# Altium schematic sheet REGENIX_Relais_24V_1.SchDoc
size Tabloid; Date: Date; Author: Author 1; DocumentNumber: 2; Revision: 1; SheetNumber: 14; SheetTotal: 17; Size: 11x17; Sheet_Name: BATTERY PROTECTION & AUXILIARY
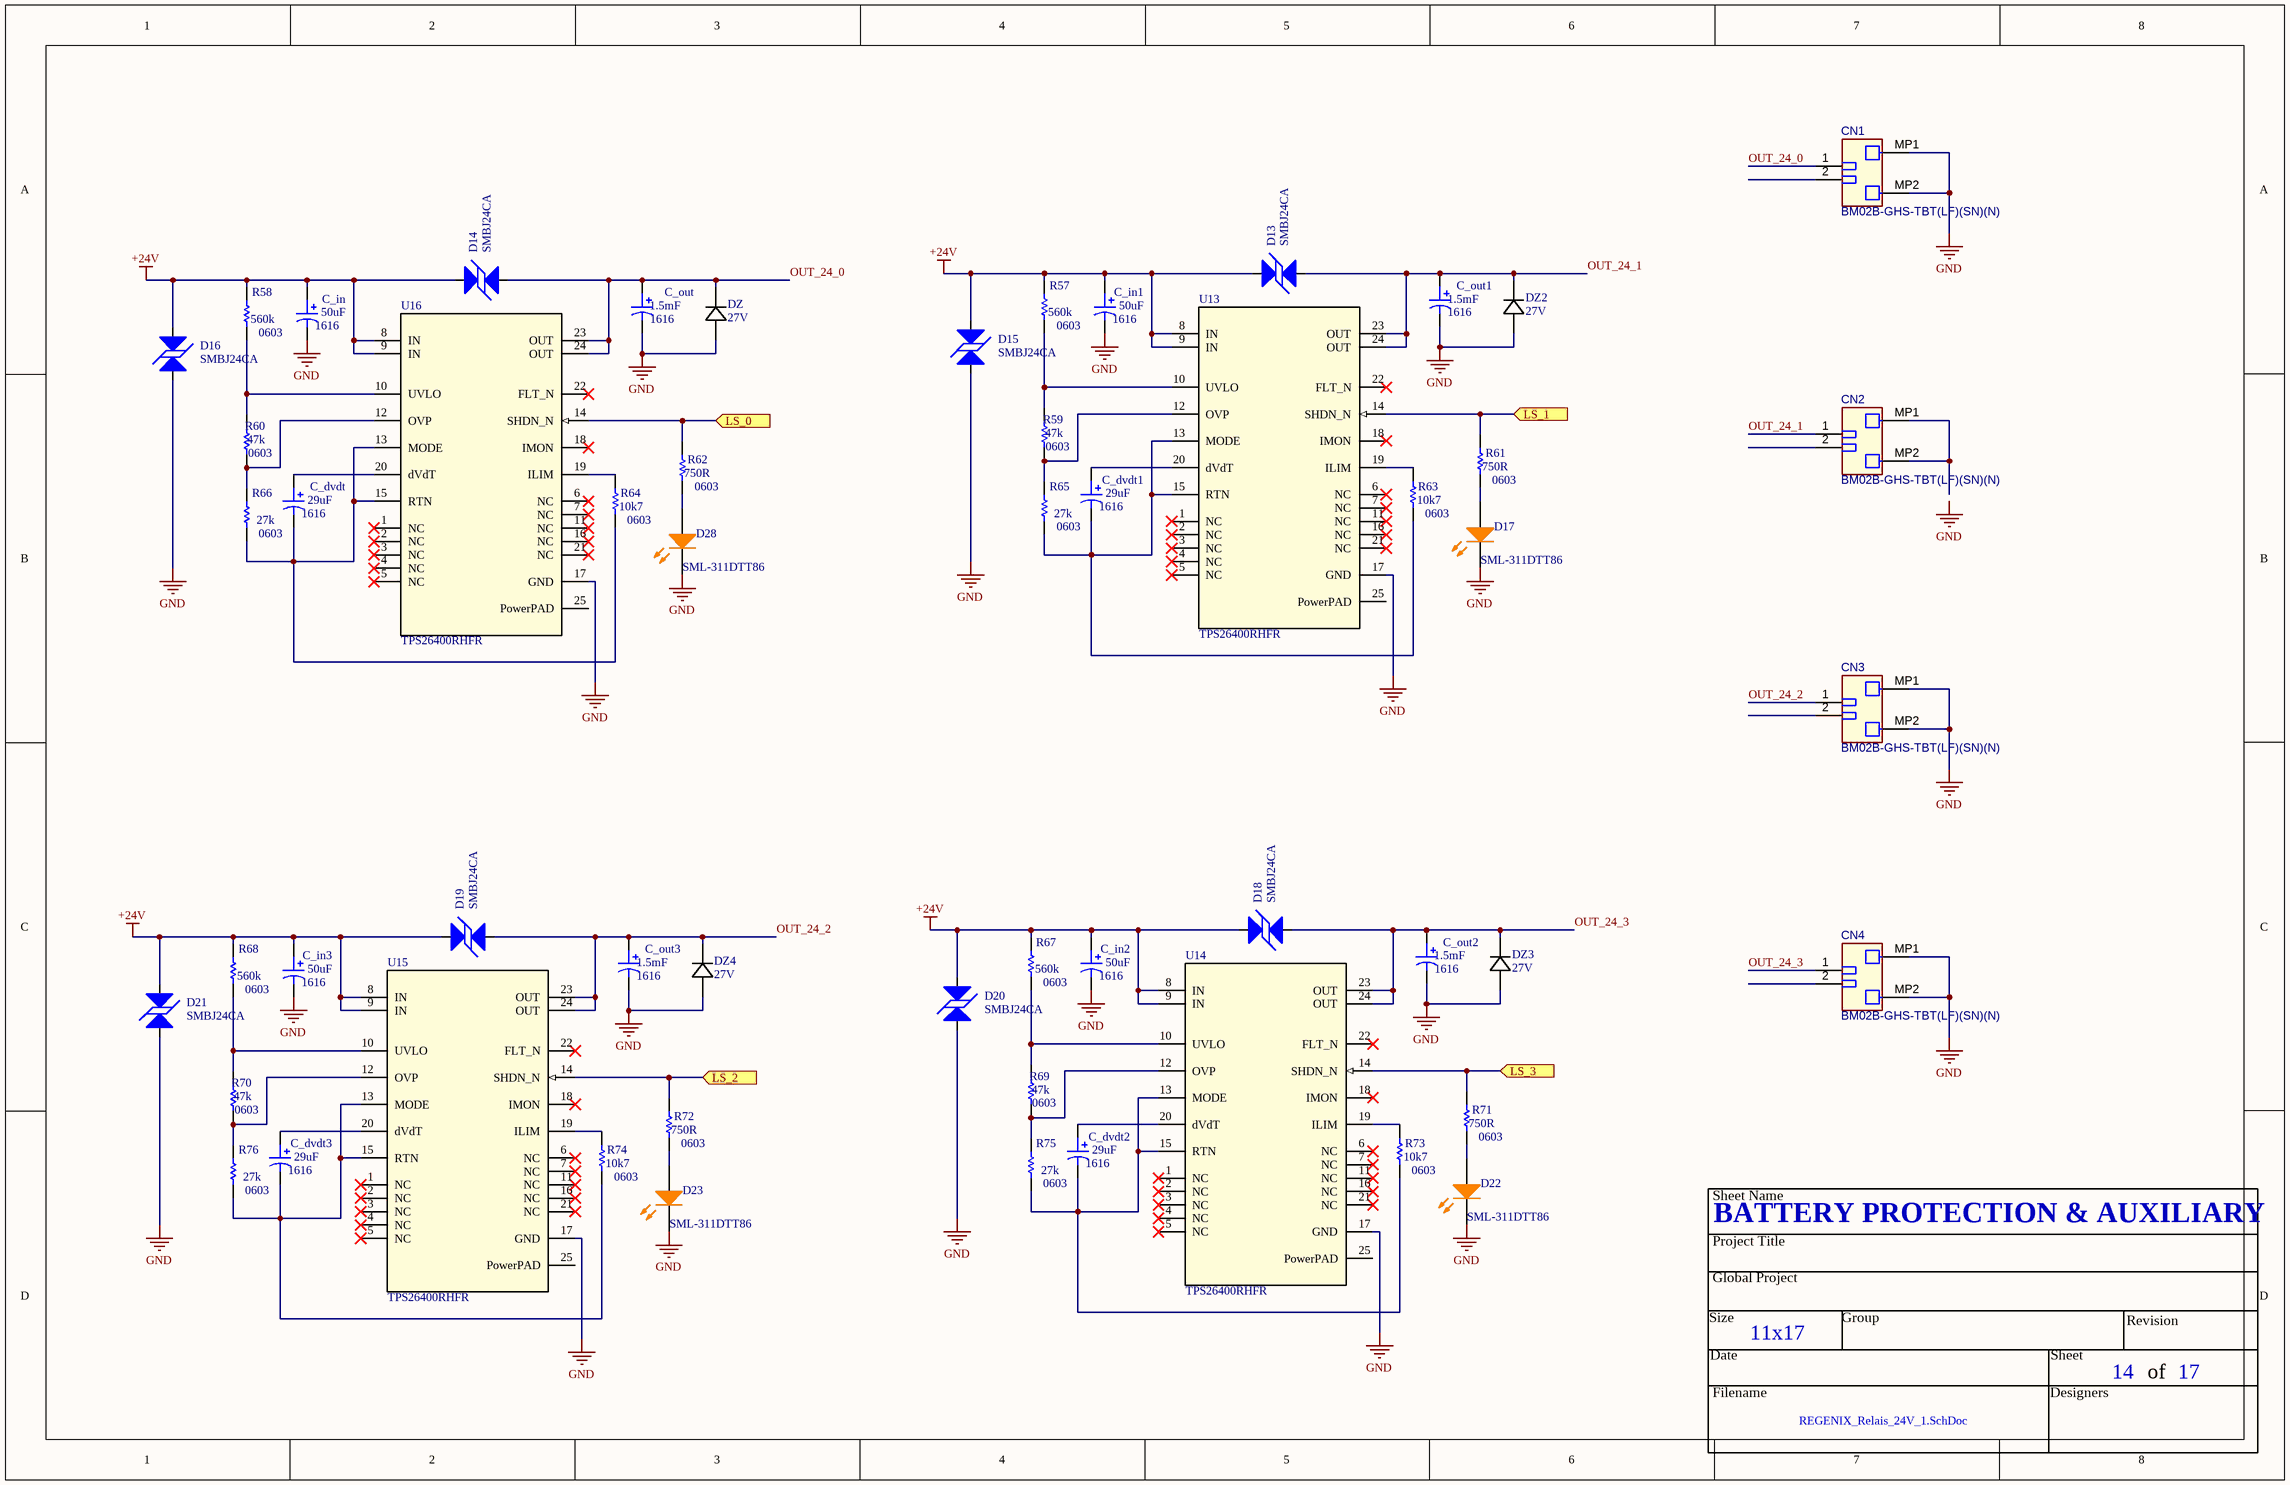
[diagram p0: REGENIX_Relais_24V_1.SchDoc]

## Parts
C_dvdt  value 29uF  Package: 1616  [CAP_ALU_1616_vishay]  (hidden comment: MAL214699108E3)
C_dvdt1  value 29uF  Package: 1616  [CAP_ALU_1616_vishay]  (hidden comment: MAL214699108E3)
C_dvdt2  value 29uF  Package: 1616  [CAP_ALU_1616_vishay]  (hidden comment: MAL214699108E3)
C_dvdt3  value 29uF  Package: 1616  [CAP_ALU_1616_vishay]  (hidden comment: MAL214699108E3)
C_in  value 50uF  Package: 1616  [CAP_ALU_1616_vishay]  (hidden comment: MAL214699108E3)
C_in1  value 50uF  Package: 1616  [CAP_ALU_1616_vishay]  (hidden comment: MAL214699108E3)
C_in2  value 50uF  Package: 1616  [CAP_ALU_1616_vishay]  (hidden comment: MAL214699108E3)
C_in3  value 50uF  Package: 1616  [CAP_ALU_1616_vishay]  (hidden comment: MAL214699108E3)
C_out  value 1.5mF  Package: 1616  [CAP_ALU_1616_vishay]  (hidden comment: MAL214699108E3)
C_out1  value 1.5mF  Package: 1616  [CAP_ALU_1616_vishay]  (hidden comment: MAL214699108E3)
C_out2  value 1.5mF  Package: 1616  [CAP_ALU_1616_vishay]  (hidden comment: MAL214699108E3)
C_out3  value 1.5mF  Package: 1616  [CAP_ALU_1616_vishay]  (hidden comment: MAL214699108E3)
CN1  BM02B-GHS-TBT(LF)(SN)(N)  [JST-BM02B-GHS-TBT_V]
CN2  BM02B-GHS-TBT(LF)(SN)(N)  [JST-BM02B-GHS-TBT_V]
CN3  BM02B-GHS-TBT(LF)(SN)(N)  [JST-BM02B-GHS-TBT_V]
CN4  BM02B-GHS-TBT(LF)(SN)(N)  [JST-BM02B-GHS-TBT_V]
D13  SMBJ24CA  [TVS_PWR_SMBJ36CA]
D14  SMBJ24CA  [TVS_PWR_SMBJ36CA]
D15  SMBJ24CA  [TVS_PWR_SMBJ36CA]
D16  SMBJ24CA  [TVS_PWR_SMBJ36CA]
D17  SML-311DTT86  [LED_0603]
D18  SMBJ24CA  [TVS_PWR_SMBJ36CA]
D19  SMBJ24CA  [TVS_PWR_SMBJ36CA]
D20  SMBJ24CA  [TVS_PWR_SMBJ36CA]
D21  SMBJ24CA  [TVS_PWR_SMBJ36CA]
D22  SML-311DTT86  [LED_0603]
D23  SML-311DTT86  [LED_0603]
D28  SML-311DTT86  [LED_0603]
DZ  27V  [SOD123_DIO]
DZ2  27V  [SOD123_DIO]
DZ3  27V  [SOD123_DIO]
DZ4  27V  [SOD123_DIO]
R57  Package: 0603  Precision: 560k  [RES_0603]  (hidden comment: RES - 0603)
R58  Package: 0603  Precision: 560k  [RES_0603]  (hidden comment: RES - 0603)
R59  Package: 0603  Precision: 47k  [RES_0603]  (hidden comment: RES - 0603)
R60  Package: 0603  Precision: 47k  [RES_0603]  (hidden comment: RES - 0603)
R61  Package: 0603  Precision: 750R  [RES_0603]  (hidden comment: RES - 0603)
R62  Package: 0603  Precision: 750R  [RES_0603]  (hidden comment: RES - 0603)
R63  Package: 0603  Precision: 10k7  [RES_0603]  (hidden comment: RES - 0603)
R64  Package: 0603  Precision: 10k7  [RES_0603]  (hidden comment: RES - 0603)
R65  Package: 0603  Precision: 27k  [RES_0603]  (hidden comment: RES - 0603)
R66  Package: 0603  Precision: 27k  [RES_0603]  (hidden comment: RES - 0603)
R67  Package: 0603  Precision: 560k  [RES_0603]  (hidden comment: RES - 0603)
R68  Package: 0603  Precision: 560k  [RES_0603]  (hidden comment: RES - 0603)
R69  Package: 0603  Precision: 47k  [RES_0603]  (hidden comment: RES - 0603)
R70  Package: 0603  Precision: 47k  [RES_0603]  (hidden comment: RES - 0603)
R71  Package: 0603  Precision: 750R  [RES_0603]  (hidden comment: RES - 0603)
R72  Package: 0603  Precision: 750R  [RES_0603]  (hidden comment: RES - 0603)
R73  Package: 0603  Precision: 10k7  [RES_0603]  (hidden comment: RES - 0603)
R74  Package: 0603  Precision: 10k7  [RES_0603]  (hidden comment: RES - 0603)
R75  Package: 0603  Precision: 27k  [RES_0603]  (hidden comment: RES - 0603)
R76  Package: 0603  Precision: 27k  [RES_0603]  (hidden comment: RES - 0603)
U13  TPS26400RHFR  [RHF0024A-IPC_A]
U14  TPS26400RHFR  [RHF0024A-IPC_A]
U15  TPS26400RHFR  [RHF0024A-IPC_A]
U16  TPS26400RHFR  [RHF0024A-IPC_A]

## Ports
LS_0 (in), LS_1 (in), LS_2 (in), LS_3 (in)

## Nets
+24V: C_in.1 C_in1.1 C_in2.1 C_in3.1 D13.1 D14.1 D15.1 D16.1 D18.1 D19.1 D20.1 D21.1 R57.2 R58.2 R67.2 R68.2 U13.8(IN) U13.9(IN) U14.8(IN) U14.9(IN) U15.8(IN) U15.9(IN) U16.8(IN) U16.9(IN)
GND: C_in.2 C_in1.2 C_in2.2 C_in3.2 C_out.2 C_out1.2 C_out2.2 C_out3.2 CN1.MP1 CN1.MP2 CN3.MP1 CN3.MP2 CN4.MP1 CN4.MP2 D15.2 D16.2 D17.K D20.2 D21.2 D22.K D23.K D28.K DZ.2 DZ2.2 DZ3.2 DZ4.2 U13.17(GND) U14.17(GND) U15.17(GND) U16.17(GND)
LS_0: R62.2 U16.14(SHDN_N) ; port LS_0
LS_1: R61.2 U13.14(SHDN_N) ; port LS_1
LS_2: R72.2 U15.14(SHDN_N) ; port LS_2
LS_3: R71.2 U14.14(SHDN_N) ; port LS_3
OUT_24_0: C_out.1 CN1.1 D14.2 DZ.1 U16.23(OUT) U16.24(OUT)
OUT_24_1: C_out1.1 CN2.1 D13.2 DZ2.1 U13.23(OUT) U13.24(OUT)
OUT_24_2: C_out3.1 CN3.1 D19.2 DZ4.1 U15.23(OUT) U15.24(OUT)
OUT_24_3: C_out2.1 CN4.1 D18.2 DZ3.1 U14.23(OUT) U14.24(OUT)
NetC_dvdt1_1: C_dvdt1.1 U13.20(dVdT)
NetC_dvdt1_2: C_dvdt1.2 R63.1 R65.1 U13.13(MODE) U13.15(RTN)
NetC_dvdt2_1: C_dvdt2.1 U14.20(dVdT)
NetC_dvdt2_2: C_dvdt2.2 R73.1 R75.1 U14.13(MODE) U14.15(RTN)
NetC_dvdt3_1: C_dvdt3.1 U15.20(dVdT)
NetC_dvdt3_2: C_dvdt3.2 R74.1 R76.1 U15.13(MODE) U15.15(RTN)
NetC_dvdt_1: C_dvdt.1 U16.20(dVdT)
NetC_dvdt_2: C_dvdt.2 R64.1 R66.1 U16.13(MODE) U16.15(RTN)
NetCN2_MP1: CN2.MP1 CN2.MP2
NetD17_A: D17.A R61.1
NetD22_A: D22.A R71.1
NetD23_A: D23.A R72.1
NetD28_A: D28.A R62.1
NetR57_1: R57.1 R59.2 U13.10(UVLO)
NetR58_1: R58.1 R60.2 U16.10(UVLO)
NetR59_1: R59.1 R65.2 U13.12(OVP)
NetR60_1: R60.1 R66.2 U16.12(OVP)
NetR63_2: R63.2 U13.19(ILIM)
NetR64_2: R64.2 U16.19(ILIM)
NetR67_1: R67.1 R69.2 U14.10(UVLO)
NetR68_1: R68.1 R70.2 U15.10(UVLO)
NetR69_1: R69.1 R75.2 U14.12(OVP)
NetR70_1: R70.1 R76.2 U15.12(OVP)
NetR73_2: R73.2 U14.19(ILIM)
NetR74_2: R74.2 U15.19(ILIM)

Not connected (* = marked no-connect by the designer): CN1 2; CN2 2; CN3 2; CN4 2; U13 1(NC)* 2(NC)* 3(NC)* 4(NC)* 5(NC)* 6(NC)* 7(NC)* 11(NC)* 16(NC)* 18(IMON)* 21(NC)* 22(FLT_N)* 25(PowerPAD); U14 1(NC)* 2(NC)* 3(NC)* 4(NC)* 5(NC)* 6(NC)* 7(NC)* 11(NC)* 16(NC)* 18(IMON)* 21(NC)* 22(FLT_N)* 25(PowerPAD); U15 1(NC)* 2(NC)* 3(NC)* 4(NC)* 5(NC)* 6(NC)* 7(NC)* 11(NC)* 16(NC)* 18(IMON)* 21(NC)* 22(FLT_N)* 25(PowerPAD); U16 1(NC)* 2(NC)* 3(NC)* 4(NC)* 5(NC)* 6(NC)* 7(NC)* 11(NC)* 16(NC)* 18(IMON)* 21(NC)* 22(FLT_N)* 25(PowerPAD)

## Notes on the sheet
- Labels drawn without touching a wire or pin: GND
- Sheet Name
- Project Title
- Global Project
- Revision
- Size
- Date
- Group
- Sheet
- of
- Filename
- Designers

## Library data of the parts
C_dvdt C_dvdt1-C_dvdt3 C_in C_in1-C_in3 C_out C_out1-C_out3 = CAP_ALU_MAL214699108E3: CAP - ALU 470uF 20% 50V - 1616; Current: 1.3A; Mfg: Vishay Dale; Mfg Part Number: MAL214699108E3; HelpURL: http://www.vishay.com/docs/28403/146cti.pdf; CreatedBy: Jonathan Bouchard; Temperature: -55°C to 125°C; Power: *; Supplier 1: Digikey; Supplier Part Number 1: 4442PHCT-ND
CN1-CN4 = CMP-002-00061-3: Disconnectable Crimp Style Connector, Pitch 1.25 mm, 1 x 2 Position, Height 4.05 mm, -25 to 85 degC, RoHS, Tape and Reel; Connector Type: Header,Shrouded; Mounting Technology: SurfaceMount; Case/Package: Disconnectable Crimp Style Connector, Pitch 1.25 mm, 1 x 2 Position, Height 4.05 mm; Pins: 4
D13-D16 D18-D21 = TVS_PWR_SMBJ24CA: TVS - 24V 26.7V 600W - DO214AA; Manufacturer #1: Littelfuse Inc.; Value: Vbr = 26.7V -  Clamp = 38.9V; Voltage Rating: 24V Standoff; Current Rating: 15.5A; GRAMS Lib Spec: 2.8; Magnetic Material: UNKNOWN; Polarized: NO; Tolerance: *; Power Max: 600W; HelpURL: http://www.littelfuse.com/~/media/electronics/datasheets/tvs_diodes/littelfuse_tvs_diode_smbj_datasheet.pdf.pdf; CreatedBy/Date: Arnaud Samson - 06/07/18; VerifiedBy: Jonathan Bouchard - 2018-07-13; Temperature: -65°C ~ 150°C (TJ); Package: DO214AA; Manufacturer #2: *; Note: *; Assembly Type: SMD; Part Number #2: *; Part Number #1: SMBJ24CA; Supplier 1: Digi-Key; Supplier Part Number 1: SMBJ24CALFCT-ND; Cryo: UNKNOWN
D17 D22 D23 D28 = LED_SML-311DTT86: LED - 611nM ORANGE 2mA - 0603; Voltage: 1.8V; Mfg: ROHM Semiconductor; Power: 44mW; Current: 2mA; HelpURL: http://media.digikey.com/pdf/Data%20Sheets/Rohm%20PDFs/SML-311%20Series.pdf; CreatedBy: Jonathan Bouchard; Temperature: -40°C to 85°C; Package: 0603; Precision: *; Mfg Part Number: SML-311DTT86; Supplier 1: Digikey; Supplier Part Number 1: 511-1303-1-ND
DZ DZ2-DZ4 = MMSZ5254B-7-F: DIODE ZENER 27V 500MW SOD123 MMSZ5254B-7-F; Mfr_Name: Diodes Inc
U13-U16 = TPS26400RHFR: No Description Available; Mfr_Name: Texas Instruments; TYPE: TYPE; RefDes: RefDes
R57-R76 = RES - 0603: Current: *; CreatedBy: Jonathan Bouchard